# Altium schematic sheet Out.SchDoc
size A4; SheetNumber: 5; SheetTotal: 6
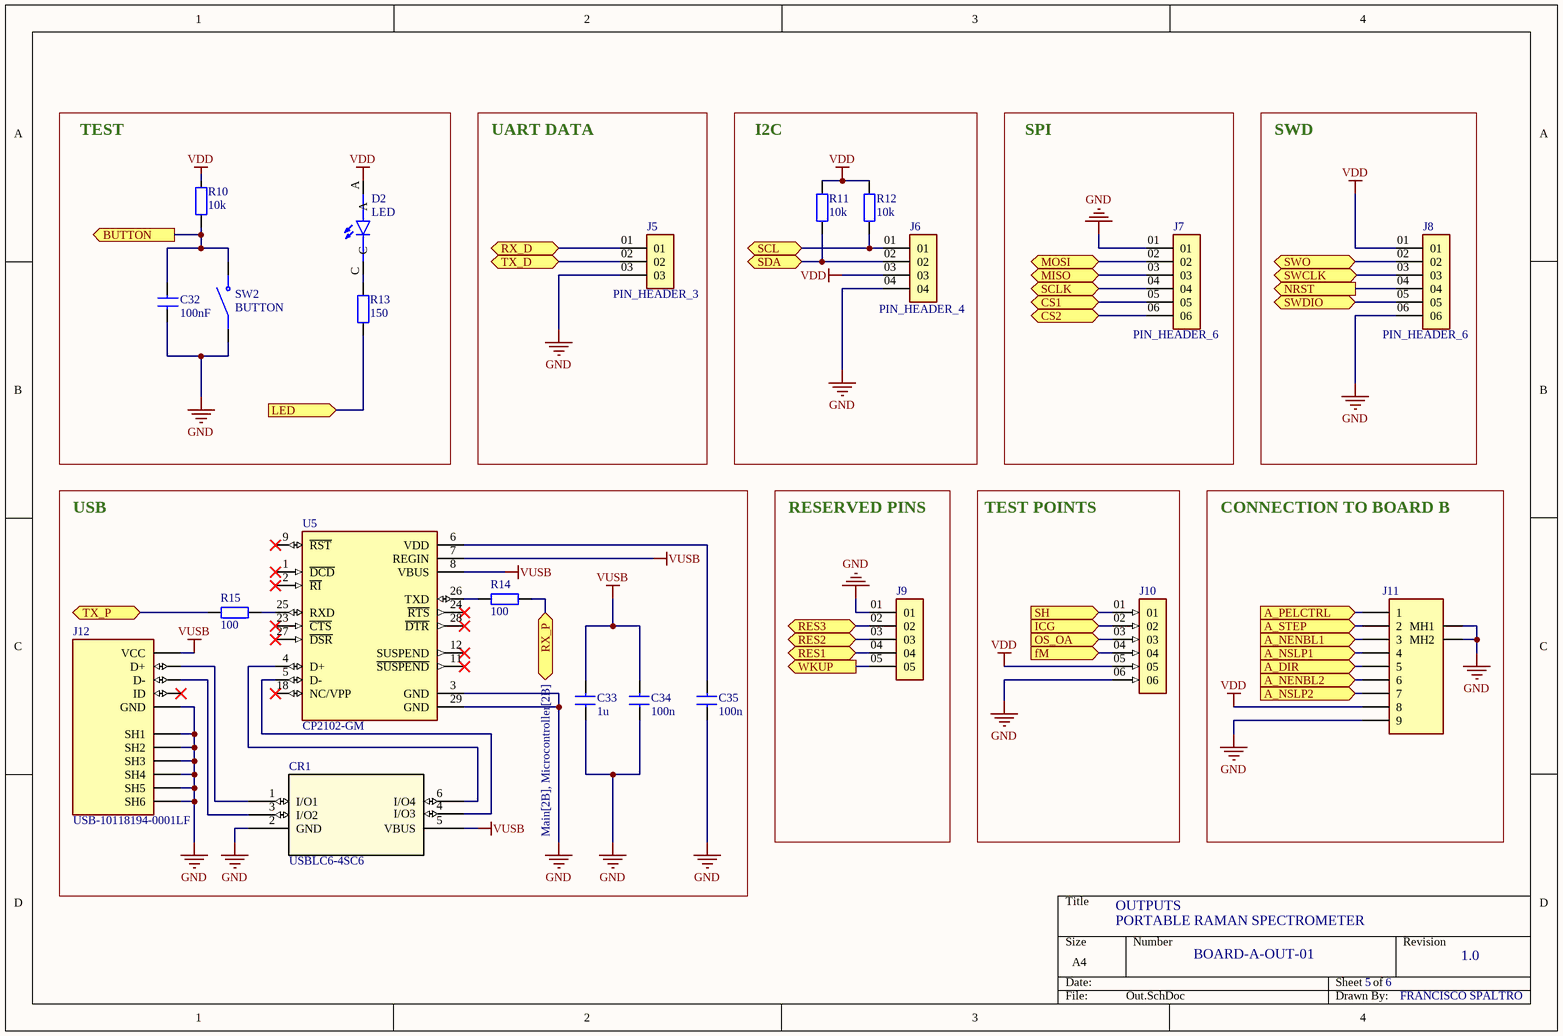
[diagram p0: Out.SchDoc]

## Parts
C32  100nF  [RES_0805]
C33  1u  [RES_0805]
C34  100n  [RES_0805]
C35  100n  [RES_0805]
CR1  USBLC6-4SC6  [SOT23-6L_STM-M]
D2  LED  [LEDC1608X35N]
J5  PIN_HEADER_3  [GEN_PIN3]
J6  PIN_HEADER_4  [GEN_PIN4]
J7  PIN_HEADER_6  [GEN_PIN6]
J8  PIN_HEADER_6  [GEN_PIN6]
J9  PIN_HEADER_5  [GEN_PIN5]  (value not drawn)
J10  PIN_HEADER_6  [GEN_PIN6]  (value not drawn)
J11  Phoenix9V_1821465  [PHOENIX_1821465]  (value not drawn)
J12  USB-10118194-0001LF  [AMPHENOL_10118194-0001LF]
R10  10k  [RES_0805]
R11  10k  [RES_0805]
R12  10k  [RES_0805]
R13  150  [RES_0805]
R14  100  [RES_0805]
R15  100  [RES_0805]
SW2  BUTTON  [SW_B3U-1000P]
U5  CP2102-GM  [QFN50P500X500X100-29N]

## Blocks framed on the sheet
TEST: C32 D2 R10 R13 SW2
UART DATA: J5
I2C: J6 R11 R12
SPI: J7
SWD: J8
USB: C33-C35 CR1 J12 R14 R15 U5
RESERVED PINS: J9
TEST POINTS: J10
CONNECTION TO BOARD B: J11

## Ports
A_DIR (in, see Main[3A], Microcontroller[3C]), A_NENBL1 (in, see Main[3B], Microcontroller[2C]), A_NENBL2 (in, see Main[3B], Microcontroller[3C]), A_NSLP1 (in, see Main[3B], Microcontroller[2C]), A_NSLP2 (in, see Main[3B], Microcontroller[3C]), A_PELCTRL (in, see Main[3B], Microcontroller[3B]), A_STEP (in, see Main[3B], Microcontroller[3B]), BUTTON (out, see Main[2C], Microcontroller[2C]), CS1 (bidir, see Main[2B], Microcontroller[3B]), CS2 (bidir, see Main[2B], Microcontroller[2B]), fM (in, see Main[3C], Microcontroller[2B], Sensor[2A]), ICG (in, see Main[3C], Microcontroller[2B], Sensor[2A]), LED (in, see Main[2B], Microcontroller[3B]), MISO (bidir, see Main[2B], Microcontroller[3B]), MOSI (bidir, see Main[2B], Microcontroller[3B]), NRST (out, see Main[2B], Microcontroller[2A]), OS_OA (in, see Main[3C], Microcontroller[1B], Sensor[4B]), RES1 (bidir, see Main[2C], Microcontroller[3B]), RES2 (bidir, see Main[2C], Microcontroller[2C]), RES3 (bidir, see Main[2C], Microcontroller[3B]), RX_D (bidir, see Main[2A], Microcontroller[3B]), RX_P (bidir, see Main[2B], Microcontroller[2B]), SCL (bidir, see Main[2A], Microcontroller[2B], Sensor[1C]), SCLK (bidir, see Main[2B], Microcontroller[3B]), SDA (bidir, see Main[2A], Microcontroller[3C], Sensor[1C]), SH (in, see Main[3C], Microcontroller[2B], Sensor[2A]), SWCLK (bidir, see Main[2B], Microcontroller[2B]), SWDIO (bidir, see Main[2B], Microcontroller[2B]), SWO (bidir, see Main[2B], Microcontroller[2C]), TX_D (bidir, see Main[2A], Microcontroller[3B]), TX_P (bidir, see Main[2B], Microcontroller[2B]), WKUP (out, see Main[2B], Microcontroller[2B])

## Nets
GND: C32.2 C33.1 C34.1 C35.1 CR1.2(GND) J5.03 J6.04 J7.01 J8.06 J9.01 J10.06 J11.9 J11.MH1 J11.MH2 J12.5(GND) J12.SH1 J12.SH2 J12.SH3 J12.SH4 J12.SH5 J12.SH6 SW2.1 U5.3(GND) U5.29(GND)
VDD: D2.A J6.03 J8.01 J10.05 J11.8 R10.2 R11.2 R12.2
VUSB: C33.2 C34.2 CR1.5(VBUS) J12.1(VCC) U5.7(REGIN) U5.8(VBUS)
A_DIR: J11.5 ; port A_DIR
A_NENBL1: J11.3 ; port A_NENBL1
A_NENBL2: J11.6 ; port A_NENBL2
A_NSLP1: J11.4 ; port A_NSLP1
A_NSLP2: J11.7 ; port A_NSLP2
A_PELCTRL: J11.1 ; port A_PELCTRL
A_STEP: J11.2 ; port A_STEP
BUTTON: C32.1 R10.1 SW2.2 ; port BUTTON
CS1: J7.05 ; port CS1
CS2: J7.06 ; port CS2
fM: J10.04 ; port fM
ICG: J10.02 ; port ICG
LED: R13.1 ; port LED
MISO: J7.03 ; port MISO
MOSI: J7.02 ; port MOSI
NRST: J8.04 ; port NRST
OS_OA: J10.03 ; port OS_OA
RES1: J9.04 ; port RES1
RES2: J9.03 ; port RES2
RES3: J9.02 ; port RES3
RX_D: J5.01 ; port RX_D
RX_P: R14.2 ; port RX_P
SCL: J6.01 R12.1 ; port SCL
SCLK: J7.04 ; port SCLK
SDA: J6.02 R11.1 ; port SDA
SH: J10.01 ; port SH
SWCLK: J8.03 ; port SWCLK
SWDIO: J8.05 ; port SWDIO
SWO: J8.02 ; port SWO
TX_D: J5.02 ; port TX_D
TX_P: R15.1 ; port TX_P
WKUP: J9.05 ; port WKUP
NetC35_2: C35.2 U5.6(VDD)
NetCR1_1: CR1.1(I/O1) J12.3(D+)
NetCR1_3: CR1.3(I/O2) J12.2(D-)
NetCR1_4: CR1.4(I/O3) U5.5(D-)
NetCR1_6: CR1.6(I/O4) U5.4(D+)
NetD2_C: D2.C R13.2
NetR14_1: R14.1 U5.26(TXD)
NetR15_2: R15.2 U5.25(RXD)

Not connected (* = marked no-connect by the designer): J12 4(ID)*; U5 1(~{DCD})* 2(~{RI})* 9(~{RST})* 11(~{SUSPEND})* 12(SUSPEND)* 18(NC/VPP)* 23(~{CTS})* 24(~{RTS})* 27(~{DSR})* 28(~{DTR})*

## Notes on the sheet
- OUTPUTS
- PORTABLE RAMAN SPECTROMETER
- BOARD-A-OUT-01
- 5
- 6
- 1.0
- FRANCISCO SPALTRO

## Library data of the parts
C32-C35 = CAP_0805: Generic Capacitor
CR1 = USBLC6-4SC6: Very low capacitance ESD protection; Manufacturer_Name: STMicroelectronics; Copyright: Copyright (C) 2025 Ultra Librarian. All rights reserved.; Manufacturer_Part_Number: USBLC6-4SC6; RefDes: RefDes; Type: Type
D2 = LED-LTST-C190KRKT: Red 631nm LED Indication - Discrete 2V 0603 (1608 Metric); MF: Lite-On Inc.; Check_prices: https://www.snapeda.com/parts/LTST-C190KRKT/Lite-On+Inc./view-part/?ref=eda; Value: *; Purchase-URL: https://pricing.snapeda.com/search/part/LTST-C190KRKT/?ref=eda; Price: None; MP: LTST-C190KRKT; SnapEDA_Link: https://www.snapeda.com/parts/LTST-C190KRKT/Lite-On+Inc./view-part/?ref=snap; Availability: In Stock; Package: 0603 Lite-On
J5 = PIN_HEADER_3: Generic 40 mils drill size, 100 mils step; MF: Samtec Inc.; MP: TS-103-T-A; SnapEDA_Link: https://www.snapeda.com/parts/TS-103-T-A/Samtec+Inc./view-part/?ref=snap; Package: None; Value: *; Check_prices: https://www.snapeda.com/parts/TS-103-T-A/Samtec+Inc./view-part/?ref=eda
J6 = PIN_HEADER_4: Generic 40 mils drill size, 100 mils step; MF: Samtec Inc.; MP: TS-104-T-A; Check_prices: https://www.snapeda.com/parts/TS-104-T-A/Samtec+Inc./view-part/?ref=eda; Value: *; Availability: In Stock; Price: None; Package: None; SnapEDA_Link: https://www.snapeda.com/parts/TS-104-T-A/Samtec+Inc./view-part/?ref=snap; Purchase-URL: https://pricing.snapeda.com/search/part/TS-104-T-A/?ref=eda
J7 J8 J10 = PIN_HEADER_6: Generic 40 mils drill size, 100 mils step; MF: Samtec Inc.; MP: TS-106-T-A; SnapEDA_Link: https://www.snapeda.com/parts/TS-106-T-A/Samtec+Inc./view-part/?ref=snap; Package: None; Value: *; Check_prices: https://www.snapeda.com/parts/TS-106-T-A/Samtec+Inc./view-part/?ref=eda
J9 = PIN_HEADER_5: Generic 40 mils drill size, 100 mils step; MF: Samtec Inc.; MP: TS-105-T-A; Package: None; Check_prices: https://www.snapeda.com/parts/TS-105-T-A/Samtec+Inc./view-part/?ref=eda; Availability: In Stock; Value: *; Purchase-URL: https://pricing.snapeda.com/search/part/TS-105-T-A/?ref=eda; Price: None; SnapEDA_Link: https://www.snapeda.com/parts/TS-105-T-A/Samtec+Inc./view-part/?ref=snap
J11 = Phoenix9V_1821465: MF: {'manufacturer': u'Phoenix Contact'}; Package: None; Price: None; Value: *; MP: 1821465; Availability: Unavailable
J12 = USB-10118194-0001LF: Micro USB, Input Output Connectors, B TYPE RECEPTACLE with flange; MF: Amphenol ICC; SnapEDA_Link: https://www.snapeda.com/parts/10118194-0001LF/Amphenol+FCI/view-part/?ref=snap; Package: None; Value: *; MP: 10118194-0001LF; Check_prices: https://www.snapeda.com/parts/10118194-0001LF/Amphenol+FCI/view-part/?ref=eda
R10-R15 = RES_0805: Generic Capacitor
SW2 = SW-B3U-1000P: Switch Tactile N.O. SPST Round Button Gull Wing 0.05A 12VDC 1.5N SMD Embossed T/R; Price: None; MP: B3U-1000P; Availability: Unavailable; Value: *; Package: None
U5 = CP2102-GM: USB Bridge, USB to UART USB 2.0 UART Interface 28-QFN (5x5); MF: Silicon Labs; SnapEDA_Link: https://www.snapeda.com/parts/CP2102-GM/Silicon+Labs/view-part/?ref=snap; Package: QFN-28 Silicon Labs; Value: *; MP: CP2102-GM; Check_prices: https://www.snapeda.com/parts/CP2102-GM/Silicon+Labs/view-part/?ref=eda